# EAGLE schematic Full System Diagram rev1 (EAGLE 9.6.2)
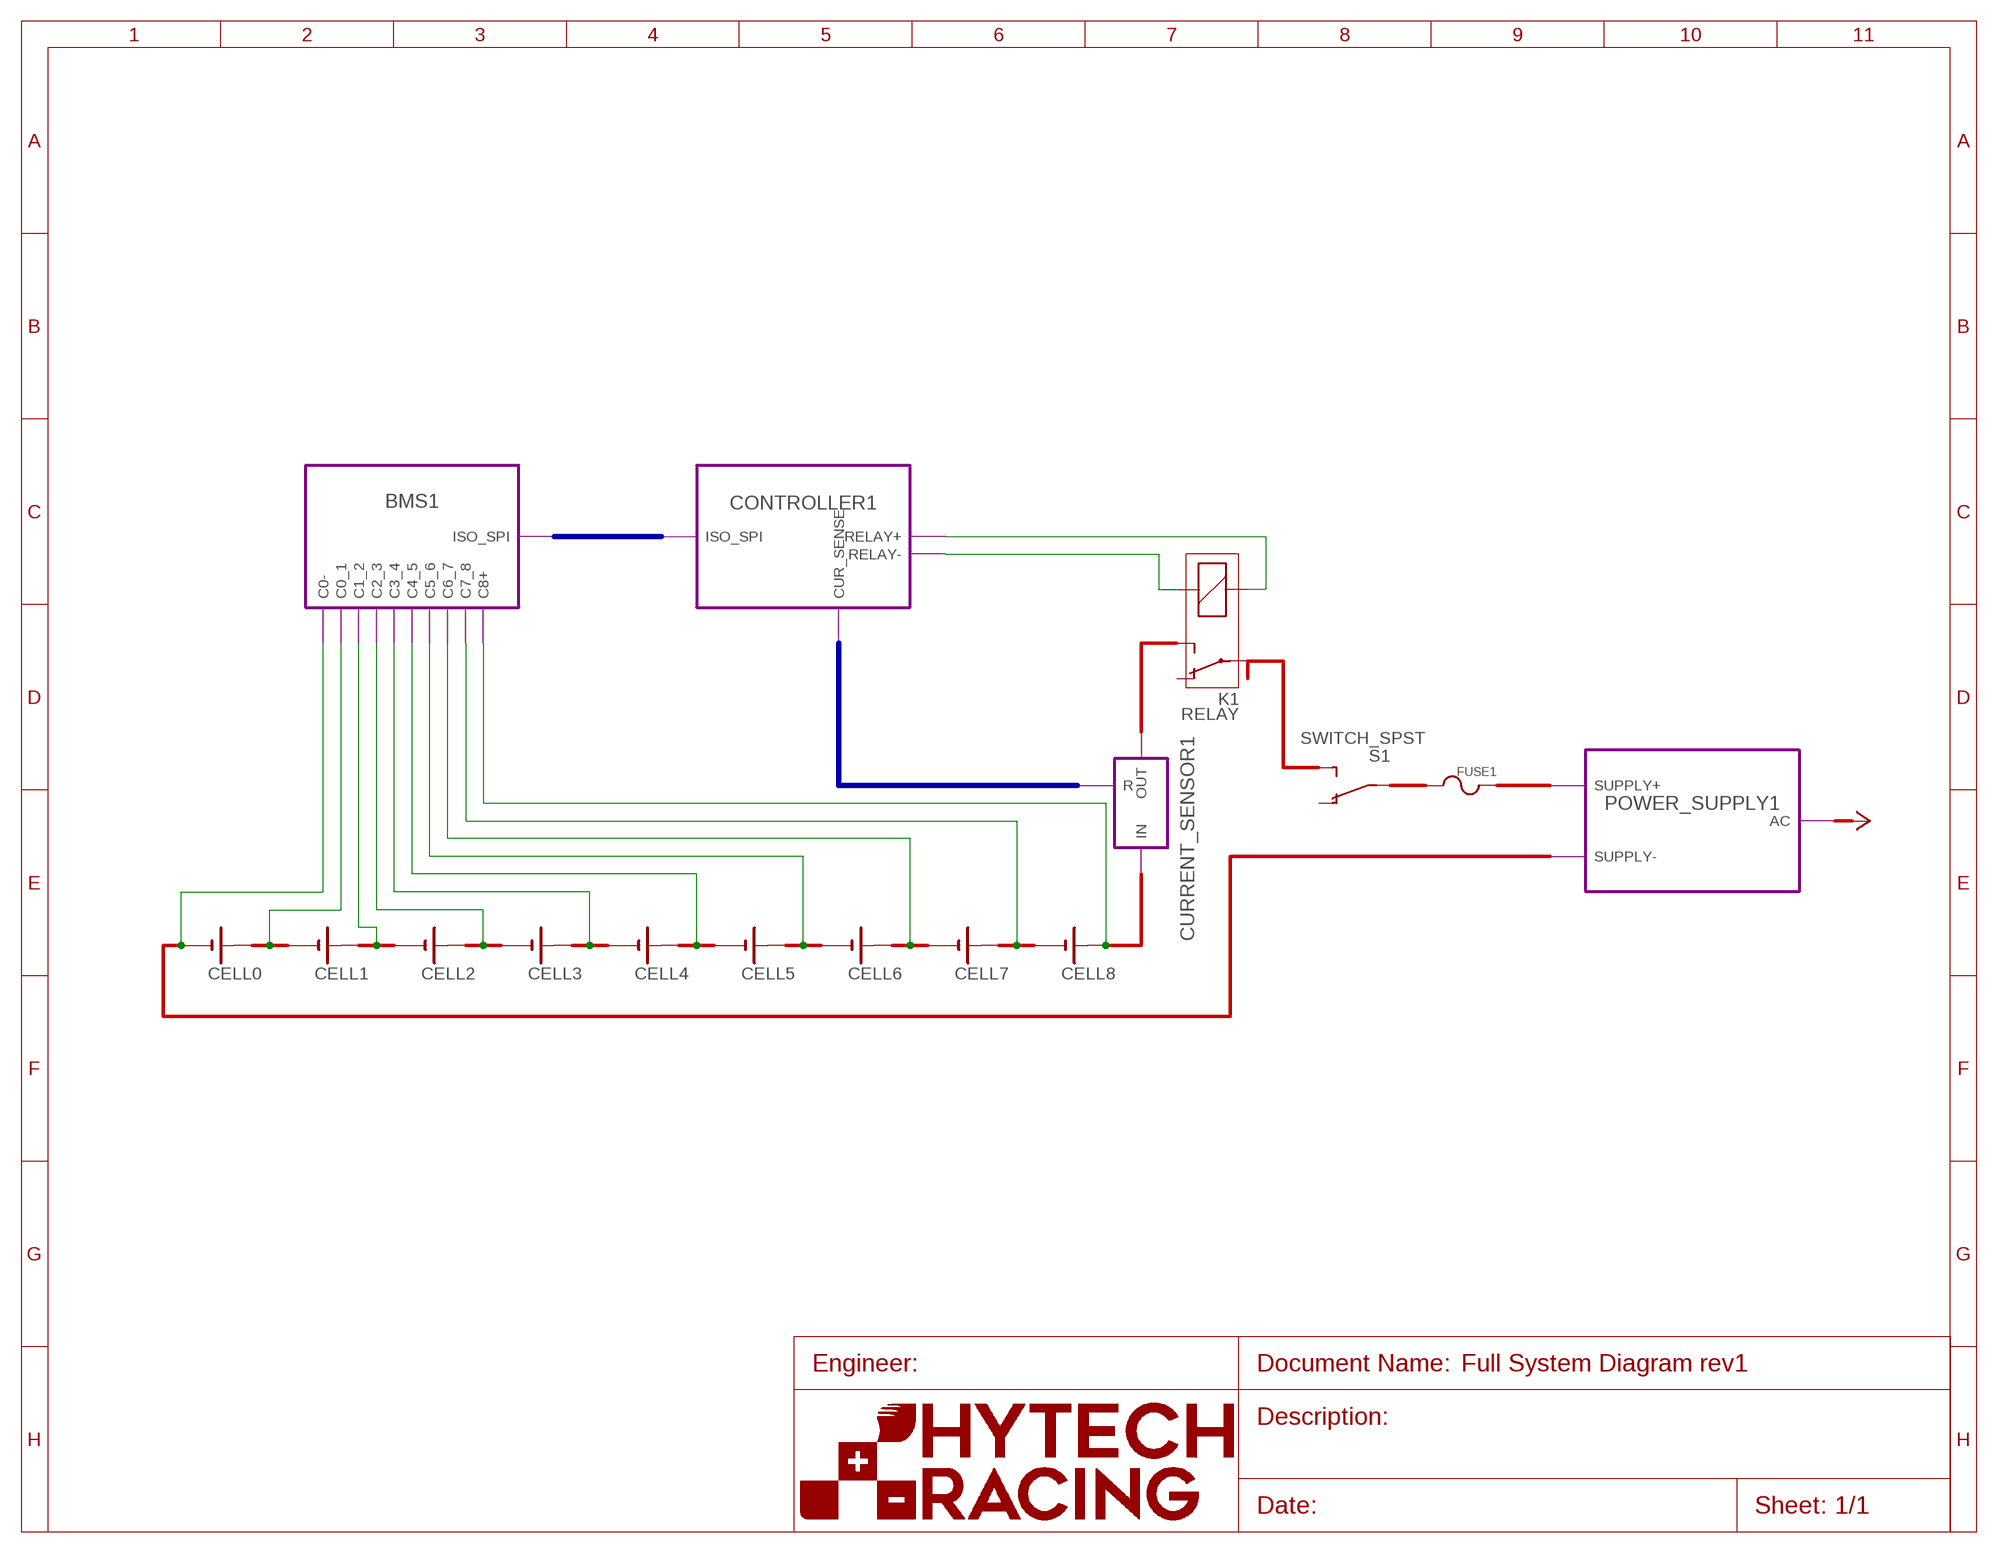
[diagram p0: schematic, sheet 1]
U$1 (FRAME_A): FRAME_DESCRIPTION: Default; ORIENTATION: LANDSCAPE; SIZE: A

## Parts
CELL0  BATTERY_1_CELL  (no package)
CELL1  BATTERY_1_CELL  (no package)
CELL2  BATTERY_1_CELL  (no package)
CELL3  BATTERY_1_CELL  (no package)
CELL4  BATTERY_1_CELL  (no package)
CELL5  BATTERY_1_CELL  (no package)
CELL6  BATTERY_1_CELL  (no package)
CELL7  BATTERY_1_CELL  (no package)
CELL8  BATTERY_1_CELL  (no package)
FUSE1  FUSE  (no package)
K1  RELAY  (no package)
S1  SWITCH_SPST  (no package)

## Module instances
POWER_SUPPLY1 = POWER_SUPPLY
BMS1 = BMS
CONTROLLER1 = CONTROLLER
CURRENT_SENSOR1 = CURRENT_SENSOR

## Nets
N$1: CELL0.- ; port BMS1.C0-
N$2: port BMS1.C0_1
N$3: port BMS1.C1_2
N$4: port BMS1.C2_3
N$5: port BMS1.C3_4
N$6: port BMS1.C4_5
N$7: port BMS1.C5_6
N$8: port BMS1.C6_7
N$9: port BMS1.C7_8
N$10: CELL8.+ ; port BMS1.C8+
N$11: K1.2 ; port CONTROLLER1.RELAY+
N$12: K1.1 ; port CONTROLLER1.RELAY-
Unconnected: CELL0.+ CELL1.+ CELL1.- CELL2.+ CELL2.- CELL3.+ CELL3.- CELL4.+ CELL4.- CELL5.+ CELL5.- CELL6.+ CELL6.- CELL7.+ CELL7.- CELL8.- FUSE1.1 FUSE1.2 K1.O K1.P K1.S S1.O S1.P S1.S

## Buses
B$1
B$2

## Library data of the parts
CELL0 CELL1-CELL8 = HyTechSymbols:BATTERY_1_CELL: Generic 1-cell battery Source: Sonnenschein
FUSE1 = HyTechSymbols:FUSE: Generic Fuse
K1 = HyTechSymbols:RELAY: RELAY 1 x switch
S1 = HyTechSymbols:SWITCH_SPST: Single Pull Single Throw Switch

## Module POWER_SUPPLY
Ports: SUPPLY+(pwr) SUPPLY-(pwr) AC(pwr)

### Library data of the parts

## Module BMS
Ports: C0-(in) C0_1(in) C1_2(in) C2_3(in) C3_4(in) C4_5(in) C5_6(in) C6_7(in) C7_8(in) C8+(in) ISO_SPI(io)

### Library data of the parts

## Module CONTROLLER
Ports: ISO_SPI(io) RELAY+(nc) RELAY-(nc) CUR_SENSE(in)

### Library data of the parts

## Module CURRENT_SENSOR
Ports: IN(io) OUT(io) R(out)

### Library data of the parts